# Altium schematic sheet main_1.SchDoc: main
size 282 x 200 mm; Date: 9/25/2019 7:26:04 PM; SheetNumber: 2; CNAME: RJ Cunningham; GateName_1: G$1; SymbolName_1: A4L-LOC; LibraryName: frames; DeviceSetName: A4L-LOC
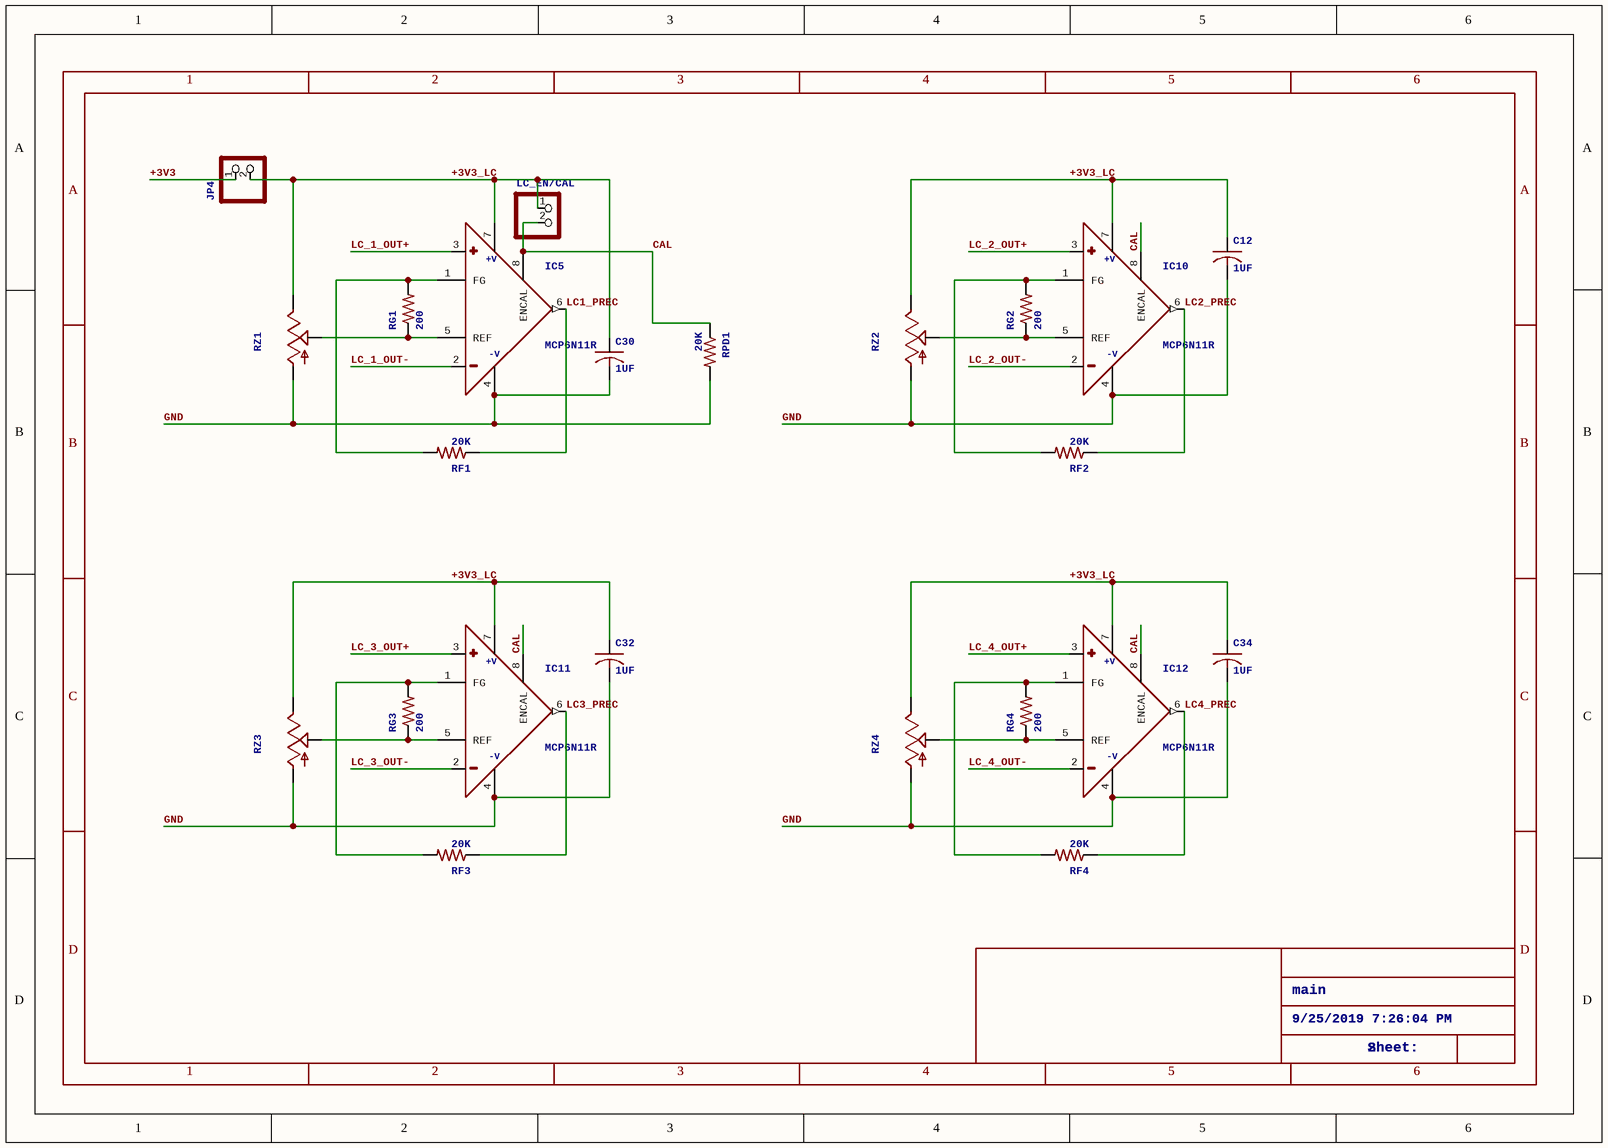
[diagram p0: main_1.SchDoc]

## Parts
C12  1UF  [C0805]
C30  1UF  [C0805]
C32  1UF  [C0805]
C34  1UF  [C0805]
IC5  MCP6N11R  [SO-8]
IC10  MCP6N11R  [SO-8]
IC11  MCP6N11R  [SO-8]
IC12  MCP6N11R  [SO-8]
JP4  PINHD-1X2  [1X02]  (value not drawn)
LC_EN/CAL  PINHD-1X2  [1X02]  (value not drawn)
RF1  20K  [R0805]
RF2  20K  [R0805]
RF3  20K  [R0805]
RF4  20K  [R0805]
RG1  200  [R0805]
RG2  200  [R0805]
RG3  200  [R0805]
RG4  200  [R0805]
RPD1  20K  [R0805]
RZ1  TRIM_US-S64W  [S64W]  (value not drawn)
RZ2  TRIM_US-S64W  [S64W]  (value not drawn)
RZ3  TRIM_US-S64W  [S64W]  (value not drawn)
RZ4  TRIM_US-S64W  [S64W]  (value not drawn)

## Nets
+3V3: JP4.1
+3V3_LC: C12.1 C30.1 C32.1 C34.1 IC5.7(+V) IC10.7(+V) IC11.7(+V) IC12.7(+V) JP4.2 LC_EN/CAL.1 RZ1.E RZ2.E RZ3.E RZ4.E
CAL: IC5.8(ENCAL) IC10.8(ENCAL) IC11.8(ENCAL) IC12.8(ENCAL) LC_EN/CAL.2 RPD1.1
GND: C12.2 C30.2 C32.2 C34.2 IC5.4(-V) IC10.4(-V) IC11.4(-V) IC12.4(-V) RPD1.2 RZ1.A RZ2.A RZ3.A RZ4.A
LC1_PREC: IC5.6(OUT) RF1.1
LC2_PREC: IC10.6(OUT) RF2.1
LC3_PREC: IC11.6(OUT) RF3.1
LC4_PREC: IC12.6(OUT) RF4.1
LC_1_OUT+: IC5.3(+)
LC_1_OUT-: IC5.2(-)
LC_2_OUT+: IC10.3(+)
LC_2_OUT-: IC10.2(-)
LC_3_OUT+: IC11.3(+)
LC_3_OUT-: IC11.2(-)
LC_4_OUT+: IC12.3(+)
LC_4_OUT-: IC12.2(-)
NetIC5_1: IC5.1(FG) RF1.2 RG1.2
NetIC5_5: IC5.5(REF) RG1.1 RZ1.S
NetIC10_1: IC10.1(FG) RF2.2 RG2.2
NetIC10_5: IC10.5(REF) RG2.1 RZ2.S
NetIC11_1: IC11.1(FG) RF3.2 RG3.2
NetIC11_5: IC11.5(REF) RG3.1 RZ3.S
NetIC12_1: IC12.1(FG) RF4.2 RG4.2
NetIC12_5: IC12.5(REF) RG4.1 RZ4.S

## Notes on the sheet
- main
- 9/25/2019 7:26:04 PM
- 2
- Sheet:
- 1
- 3
- 4
- 5
- 6
- A
- B
- C
- D

## Library data of the parts
C12 C30 C32 C34 = C-USC0805: CAPACITOR, American symbol; GateName_1: G$1; SymbolName_1: C-US; DeviceName: C0805; LibraryName: rcl; DeviceSetName: C-US; SPICEPREFIX: C
IC5 IC10-IC12 = MCP6N11R: Low Cost, Low Power, Instrumentation AmplifierSource: http://www.analog.com/UploadedFiles/Data_Sheets/37793330023930AD620_e.pdf; MPN: AD620AR; GateName_1: G$1; DeviceName: R; SymbolName_1: MCP6N11; LibraryName: microchip-extra; DeviceSetName: MCP6N11; MF: *; OC_FARNELL: 1464424; OC_NEWARK: 05F7109; +V: +V; -V: -V
JP4 LC_EN/CAL = PINHD-1X2: PIN HEADER; GateName_1: G$1; SymbolName_1: PINHD2; LibraryName: pinhead; DeviceSetName: PINHD-1X2
RF1-RF4 RG1-RG4 RPD1 = R-US_R0805: RESISTOR, American symbol; GateName_1: G$1; SymbolName_1: R-US; DeviceSetName: R-US_; DeviceName: R0805; LibraryName: rcl
RZ1-RZ4 = TRIM_US-S64W: POTENTIOMETER; GateName_1: G$1; SymbolName_1: POT_US-; DeviceName: S64W; LibraryName: pot; DeviceSetName: TRIM_US-